# EAGLE design Solar Charge Controller_ver2 (EAGLE 9.6.2)
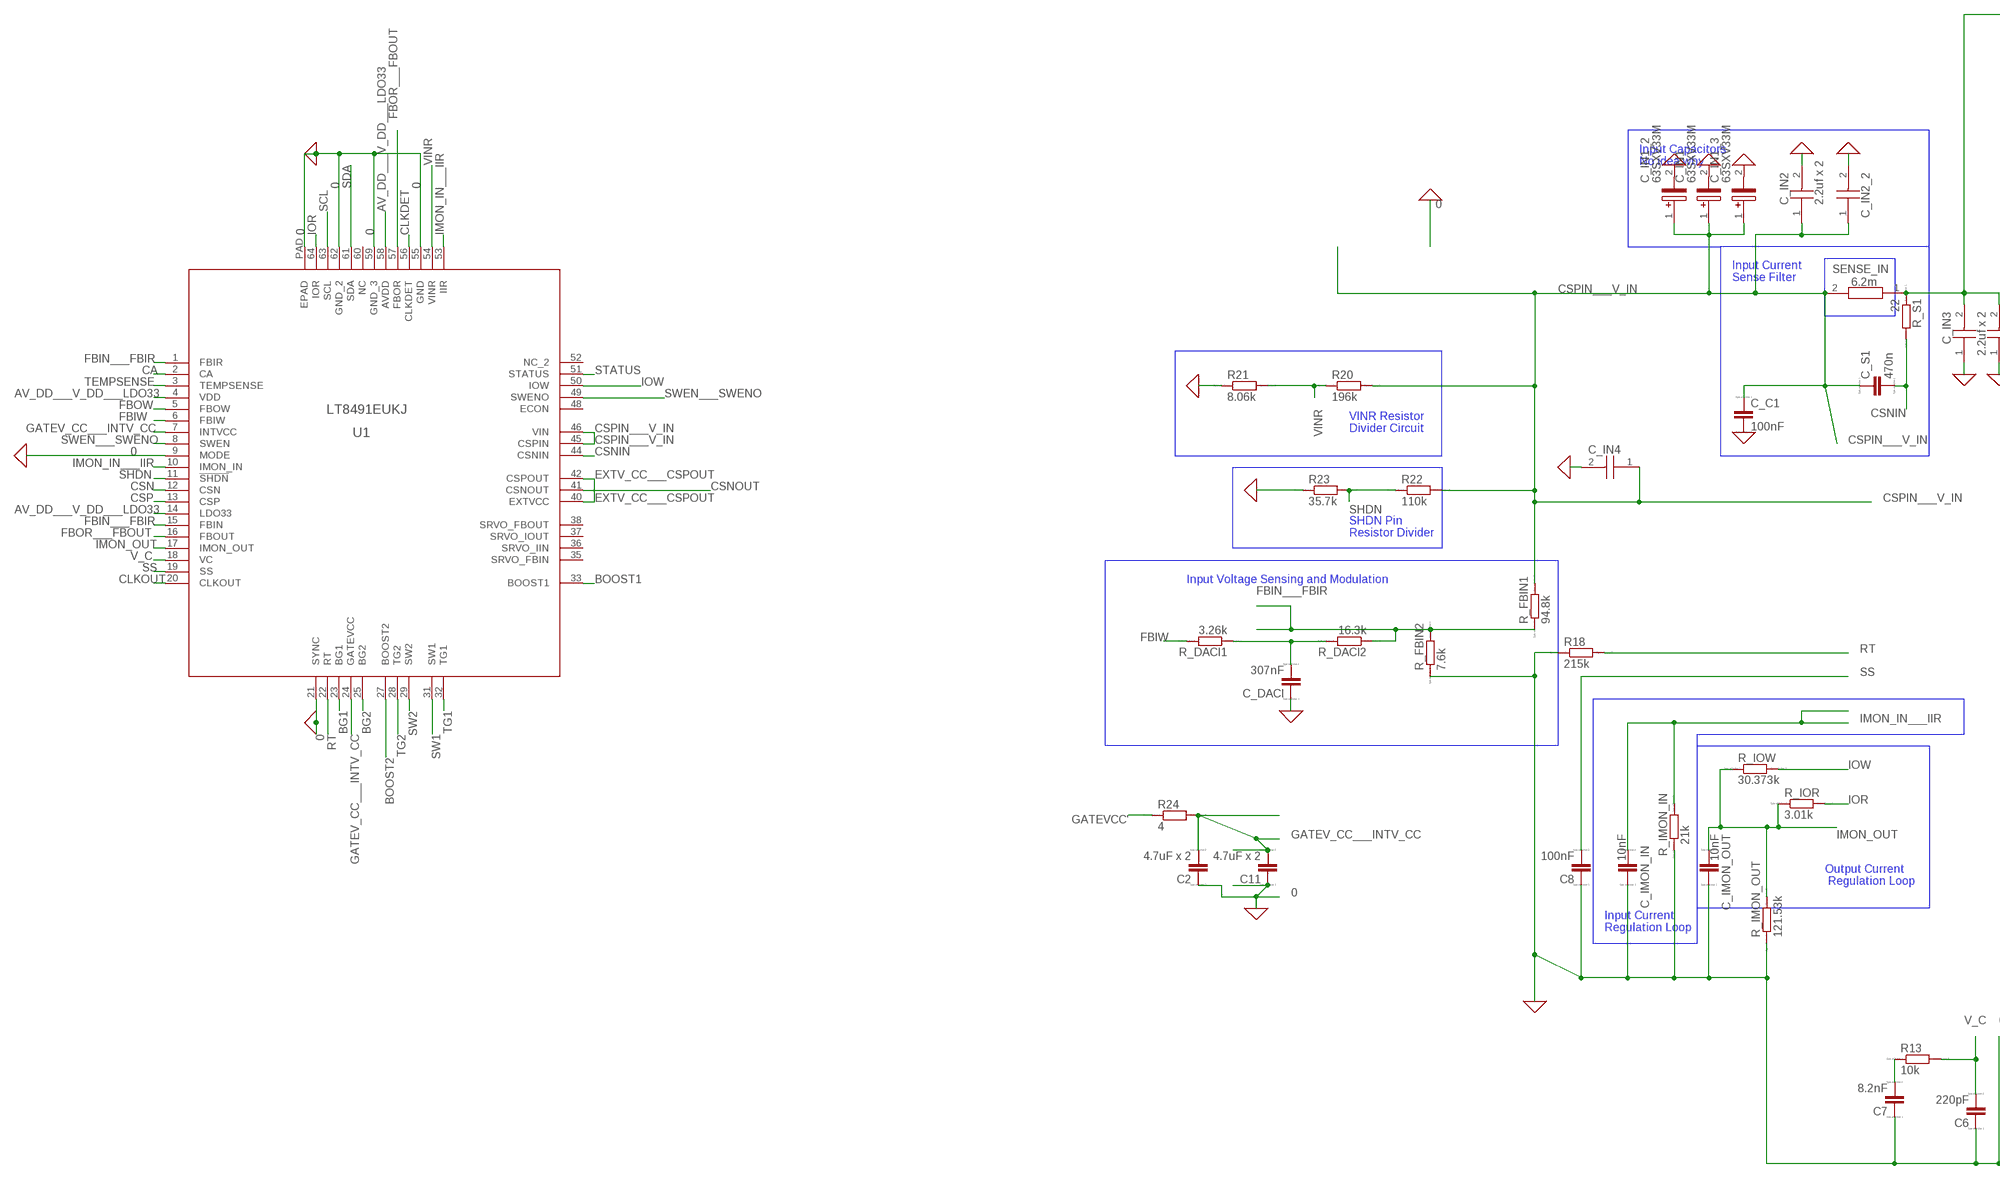
[diagram p0: schematic, sheet 1, part 1 of 2]
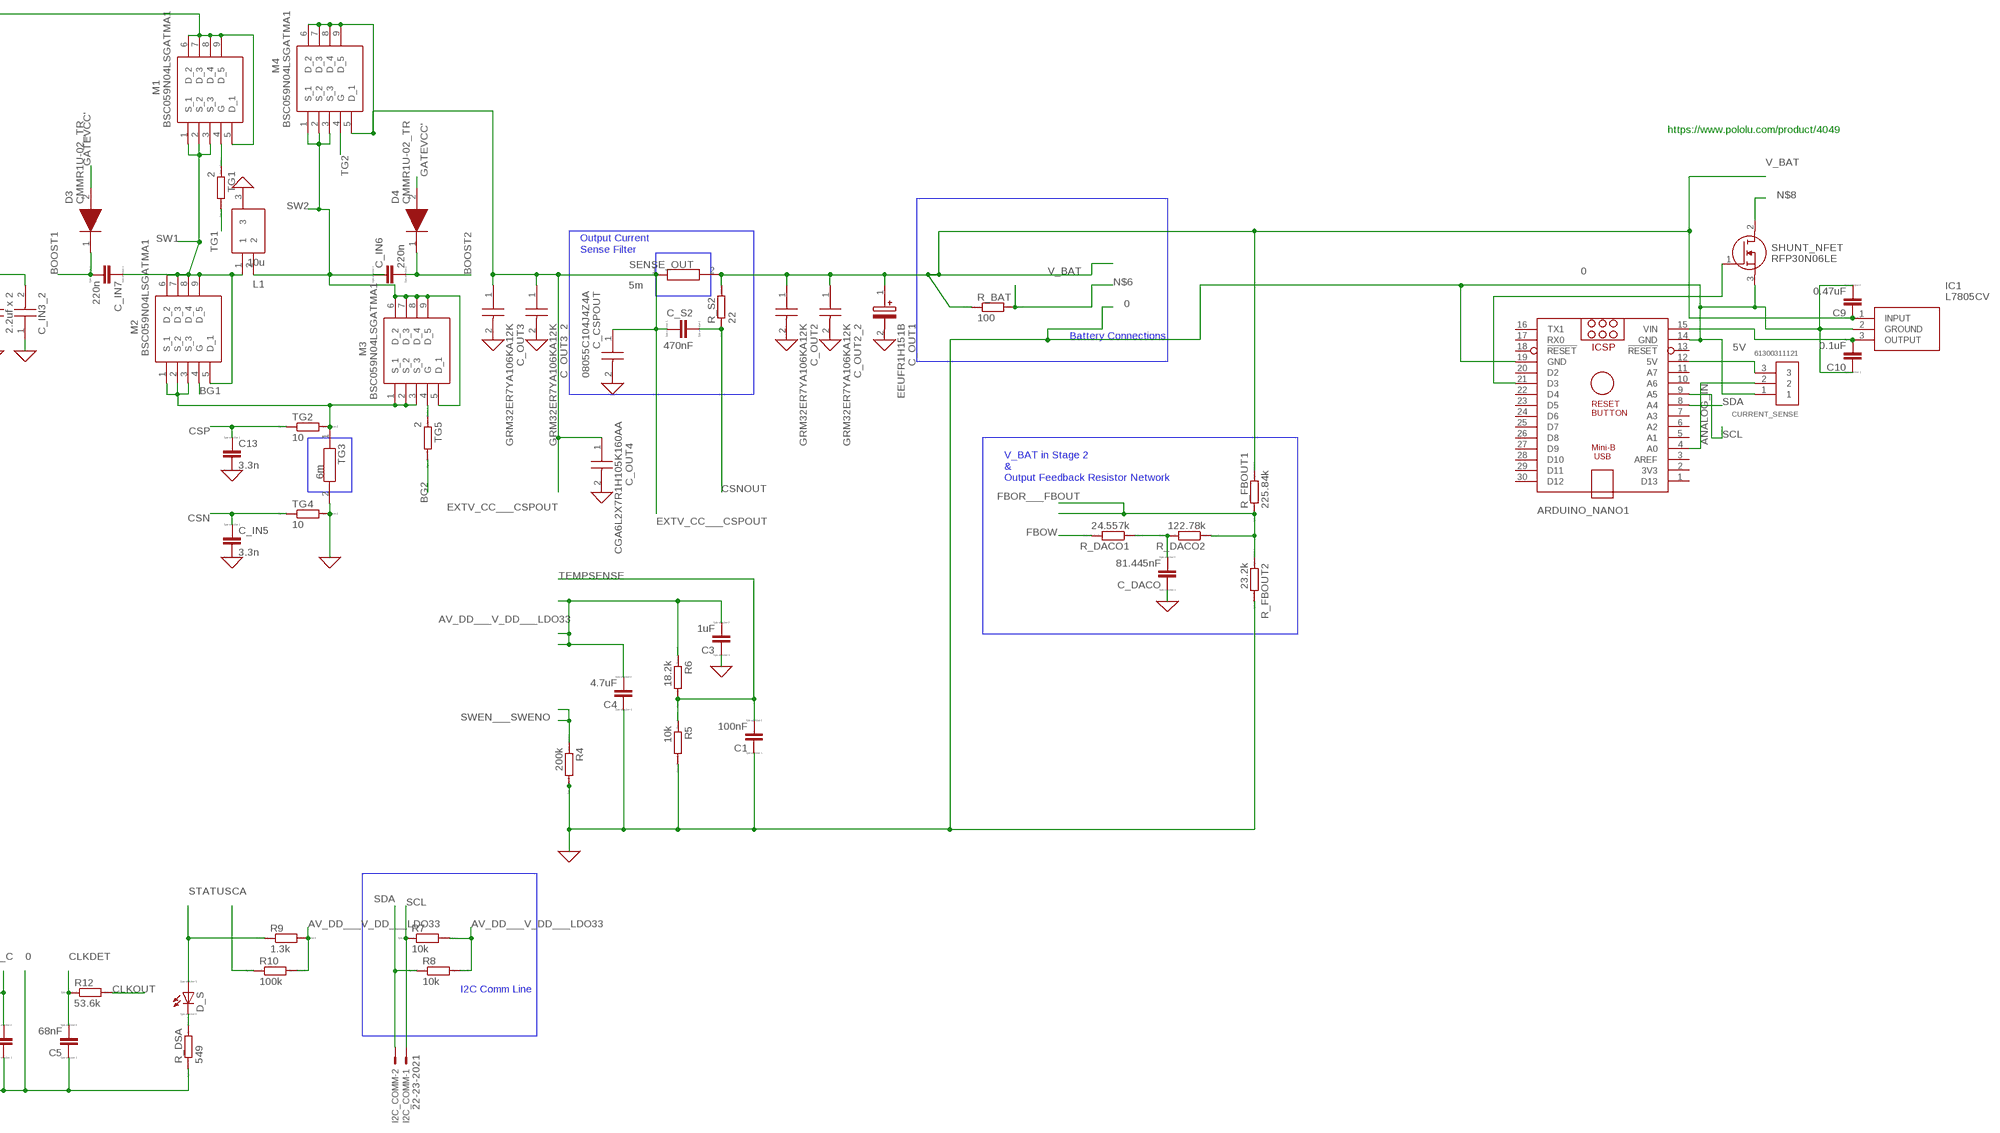
[diagram p1: schematic, sheet 1, part 2 of 2]

## Parts
ARDUINO_NANO1  ARDUINO_NANO  [ARDUINO_NANO]
C1  100nF  CC1206  [C1206]
C2  4.7uF x 2  CC1206  [C1206]
C3  1uF  CC1206  [C1206]
C4  4.7uF  CC1206  [C1206]
C5  68nF  CC0603  [C0603]
C6  220pF  CC1206  [C1206]
C7  8.2nF  CC1206  [C1206]
C8  100nF  CC1206  [C1206]
C9  0.47uF  CC1206  [C1206]
C10  0.1uF  CC1206  [C1206]
C11  4.7uF x 2  CC1206  [C1206]
C13  3.3n  CC1206  [C1206]
C_C1  100nF  CC1206  [C1206]
C_CSPOUT  08055C104J4Z4A  [CAPC2012X127N]
C_DACI  307nF  CC1206  [C1206]
C_DACO  81.445nF  CC1206  [C1206]
C_IMON_IN  10nF  CC1206  [C1206]
C_IMON_OUT  10nF  CC1206  [C1206]
C_IN1  63SXV33M  [CAPAE830X1200N]
C_IN1_2  63SXV33M  [CAPAE830X1200N]
C_IN1_3  63SXV33M  [CAPAE830X1200N]
C_IN2  2.2uf x 2  12101C225KAT2A  [CAPC3325X279N]
C_IN2_2  2.2uf x 2  12101C225KAT2A  [CAPC3325X279N]
C_IN3  2.2uf x 2  12101C225KAT2A  [CAPC3325X279N]
C_IN3_2  2.2uf x 2  12101C225KAT2A  [CAPC3325X279N]
C_IN4  2.2uf  12101C225KAT2A  [CAPC3325X279N]
C_IN5  3.3n  CC1206  [C1206]
C_IN6  220n  CC1206  [C1206]
C_IN7  220n  CC1206  [C1206]
C_OUT1  EEUFR1H151B  [CAPPRD500W65D1000H1400]
C_OUT2  GRM32ER7YA106KA12K  [CAPC3225X270N]
C_OUT2_2  GRM32ER7YA106KA12K  [CAPC3225X270N]
C_OUT3  GRM32ER7YA106KA12K  [CAPC3225X270N]
C_OUT3_2  GRM32ER7YA106KA12K  [CAPC3225X270N]
C_OUT4  CGA6L2X7R1H105K160AA  [CAPC3225X280N]
C_S1  470n  CC1206  [C1206]
C_S2  470nF  CC1206  [C1206]
CURRENT_SENSE  61300311121  [61300311121]
D3  CMMR1U-02_TR  [SODFL3818X108N]
D4  CMMR1U-02_TR  [SODFL3818X108N]
D_S  LED_E  [LED_1206]
I2C_COMM  22-23-2021  [22-23-2021]
IC1  L7805CV  [TO255P460X1020X2008-3P]
L1  10u  SER2915H-103KL  [SER2900]
M1  BSC059N04LSGATMA1  [BSC080N03LSG]
M2  BSC059N04LSGATMA1  [BSC080N03LSG]
M3  BSC059N04LSGATMA1  [BSC080N03LSG]
M4  BSC059N04LSGATMA1  [BSC080N03LSG]
R4  200k  RR1206  [R1206]
R5  10k  RR1206  [R1206]
R6  18.2k  RR1206  [R1206]
R7  10k  RR1206  [R1206]
R8  10k  RR1206  [R1206]
R9  1.3k  RR1206  [R1206]
R10  100k  RR1206  [R1206]
R12  53.6k  RR1206  [R1206]
R13  10k  RR1206  [R1206]
R18  215k  RR1206  [R1206]
R20  196k  RR1206  [R1206]
R21  8.06k  RR1206  [R1206]
R22  110k  RR1206  [R1206]
R23  35.7k  RR1206  [R1206]
R24  4  RR1206  [R1206]
R_BAT  100  RR1206  [R1206]
R_DACI1  3.26k  RR1206  [R1206]
R_DACI2  16.3k  RR1206  [R1206]
R_DACO1  24.557k  RR1206  [R1206]
R_DACO2  122.78k  RR1206  [R1206]
R_DSA  549  RR1206  [R1206]
R_FBIN1  94.8k  RR1206  [R1206]
R_FBIN2  7.6k  RR1206  [R1206]
R_FBOUT1  225.84k  RR1206  [R1206]
R_FBOUT2  23.2k  RR1206  [R1206]
R_IMON_IN  21k  RR1206  [R1206]
R_IMON_OUT  121.53k  RR1206  [R1206]
R_IOR  3.01k  RR1206  [R1206]
R_IOW  30.373k  RR1206  [R1206]
R_S1  22  RR1206  [R1206]
R_S2  22  RR1206  [R1206]
SENSE_IN  6.2m  ERJ6LWFR006V  [RESC2012X80N]
SENSE_OUT  5m  ERJ-MP2MF5M0U  [RESC3216X89N]
SHUNT_NFET  RFP30N06LE  [TO254P470X1016X2019-3P]
TG1  2  RR1206  [R1206]
TG2  10  RR1206  [R1206]
TG3  6m  ERJ6LWFR006V  [RESC2012X80N]
TG4  10  RR1206  [R1206]
TG5  2  RR1206  [R1206]
U1  LT8491EUKJ  [QFN64(58)-UKJ-REV0_ADI]

## Nets
0: ARDUINO_NANO1.14(GND) ARDUINO_NANO1.19(GND) C1.1 C2.1 C3.1 C4.1 C5.1 C6.1 C7.1 C8.1 C9.2 C10.1 C11.1 C13.2 C_C1.2 C_CSPOUT.2 C_DACI.1 C_DACO.1 C_IMON_IN.1 C_IMON_OUT.1 C_IN1.2(-) C_IN1_2.2(-) C_IN1_3.2(-) C_IN2.2 C_IN2_2.2 C_IN3.1 C_IN3_2.1 C_IN4.2 C_IN5.2 C_OUT1.2(-) C_OUT2.2 C_OUT2_2.2 C_OUT3.2 C_OUT3_2.2 C_OUT4.2 CURRENT_SENSE.1 IC1.2(GROUND) L1.3 R4.2 R5.2 R18.1 R21.1 R23.1 R_DSA.1 R_FBIN2.1 R_FBOUT2.2 R_IMON_IN.1 R_IMON_OUT.1 SHUNT_NFET.3(S) TG3.2 TG4.2 U1.9(MODE) U1.21(SYNC) U1.55(GND) U1.59(GND_3) U1.62(GND_2) U1.PAD(EPAD) ; supply symbol labelled GND
5V: ARDUINO_NANO1.12(5V) CURRENT_SENSE.3
ANALOG_IN: ARDUINO_NANO1.4(A0) CURRENT_SENSE.2
AV_DD___V_DD___LDO33: C3.2 C4.2 R6.1 R7.2 R8.2 R9.2 R10.2 U1.4(VDD) U1.14(LDO33) U1.58(AVDD)
BG1: M2.4(G) U1.23(BG1)
BG2: TG5.2 U1.25(BG2)
BOOST1: C_IN7.2 D3.1(K) U1.33(BOOST1)
BOOST2: C_IN6.2 D4.1(K) U1.27(BOOST2)
CA: R10.1 U1.2(CA)
CLKDET: C5.2 R12.1 U1.56(CLKDET)
CLKOUT: R12.2 U1.20(CLKOUT)
CSN: C_IN5.1 TG4.1 U1.12(CSN)
CSNIN: C_S1.2 R_S1.2 U1.44(CSNIN)
CSNOUT: C_S2.2 R_S2.1 U1.41(CSNOUT)
CSP: C13.1 TG2.1 U1.13(CSP)
CSPIN___V_IN: C_C1.1 C_IN1.1(+) C_IN1_2.1(+) C_IN1_3.1(+) C_IN2.1 C_IN2_2.1 C_IN4.1 C_S1.1 R20.2 R22.2 R_FBIN1.2 SENSE_IN.2 U1.45(CSPIN) U1.46(VIN)
EXTV_CC___CSPOUT: C_CSPOUT.1 C_OUT3.1 C_OUT3_2.1 C_OUT4.1 C_S2.1 M4.5(D_1) M4.6(D_2) M4.7(D_3) M4.8(D_4) M4.9(D_5) SENSE_OUT.1 U1.40(EXTVCC) U1.42(CSPOUT)
FBIN___FBIR: R_DACI2.1 R_FBIN1.1 R_FBIN2.2 U1.1(FBIR) U1.15(FBIN)
FBIW: R_DACI1.2 U1.6(FBIW)
FBOR___FBOUT: R_DACO2.1 R_FBOUT1.1 R_FBOUT2.1 U1.16(FBOUT) U1.57(FBOR)
FBOW: R_DACO1.2 U1.5(FBOW)
GATEV_CC___INTV_CC: C2.2 C11.2 R24.2 U1.7(INTVCC) U1.24(GATEVCC)
GATEVCC': D3.2(A) D4.2(A) R24.1
IMON_IN___IIR: C_IMON_IN.2 R_IMON_IN.2 U1.10(IMON_IN) U1.53(IIR)
IMON_OUT: C_IMON_OUT.2 R_IMON_OUT.2 R_IOR.1 R_IOW.1 U1.17(IMON_OUT)
IOR: R_IOR.2 U1.64(IOR)
IOW: R_IOW.2 U1.50(IOW)
N$1: C_IN3.2 C_IN3_2.2 M1.5(D_1) M1.6(D_2) M1.7(D_3) M1.8(D_4) M1.9(D_5) R_S1.1 SENSE_IN.1
N$2: M2.1(S_1) M2.2(S_2) M2.3(S_3) M3.1(S_1) M3.2(S_2) M3.3(S_3) TG2.2 TG3.1
N$3: M1.4(G) TG1.1
N$4: C_DACI.2 R_DACI1.1 R_DACI2.2
N$5: M3.4(G) TG5.1
N$6: R_BAT.2
N$7: ARDUINO_NANO1.15(VIN) C10.2 IC1.3(OUTPUT)
N$8: SHUNT_NFET.2(D)
N$9: ARDUINO_NANO1.21(D3) SHUNT_NFET.1(G)
N$23: C_DACO.2 R_DACO1.1 R_DACO2.2
N$28: D_S.C R_DSA.2
N$32: C7.2 R13.1
RT: R18.2 U1.22(RT)
SCL: ARDUINO_NANO1.9(A5) I2C_COMM.1 R7.1 U1.63(SCL)
SDA: ARDUINO_NANO1.8(A4) I2C_COMM.2 R8.1 U1.61(SDA)
SHDN: R22.1 R23.2 U1.11(!SHDN)
SS: C8.2 U1.19(SS)
STATUS: D_S.A R9.1 U1.51(STATUS)
SW1: C_IN7.1 L1.1 M1.1(S_1) M1.2(S_2) M1.3(S_3) M2.5(D_1) M2.6(D_2) M2.7(D_3) M2.8(D_4) M2.9(D_5) U1.31(SW1)
SW2: C_IN6.1 L1.2 M3.5(D_1) M3.6(D_2) M3.7(D_3) M3.8(D_4) M3.9(D_5) M4.1(S_1) M4.2(S_2) M4.3(S_3) U1.29(SW2)
SWEN___SWENO: R4.1 U1.8(SWEN) U1.49(SWENO)
TEMPSENSE: C1.2 R5.1 R6.2 U1.3(TEMPSENSE)
TG1: TG1.2 U1.32(TG1)
TG2: M4.4(G) U1.28(TG2)
V_BAT: C9.1 C_OUT1.1(+) C_OUT2.1 C_OUT2_2.1 IC1.1(INPUT) R_BAT.1 R_FBOUT1.2 R_S2.2 SENSE_OUT.2
V_C: C6.2 R13.2 U1.18(VC)
VINR: R20.1 R21.2 U1.54(VINR)
Unconnected: ARDUINO_NANO1.1(D13) ARDUINO_NANO1.2(3V3) ARDUINO_NANO1.3(AREF) ARDUINO_NANO1.5(A1) ARDUINO_NANO1.6(A2) ARDUINO_NANO1.7(A3) ARDUINO_NANO1.10(A6) ARDUINO_NANO1.11(A7) ARDUINO_NANO1.13(!RESET) ARDUINO_NANO1.16(TX1) ARDUINO_NANO1.17(RX0) ARDUINO_NANO1.18(!RESET) ARDUINO_NANO1.20(D2) ARDUINO_NANO1.22(D4) ARDUINO_NANO1.23(D5) ARDUINO_NANO1.24(D6) ARDUINO_NANO1.25(D7) ARDUINO_NANO1.26(D8) ARDUINO_NANO1.27(D9) ARDUINO_NANO1.28(D10) ARDUINO_NANO1.29(D11) ARDUINO_NANO1.30(D12) U1.35(SRVO_FBIN) U1.36(SRVO_IIN) U1.37(SRVO_IOUT) U1.38(SRVO_FBOUT) U1.48(ECON) U1.52(NC_2) U1.60(NC)

## Notes on the sheet
- https://www.pololu.com/product/4049
- Input Capacitors
  No idea why
- Output Current
  Sense Filter
- Input Current
  Sense Filter
- Battery Connections
- VINR Resistor
  Divider Circuit
- V_BAT in Stage 2
  &
  Output Feedback Resistor Network
- SHDN Pin
  Resistor Divider
- Input Voltage Sensing and Modulation
- Output Current
   Regulation Loop
- Input Current
  Regulation Loop
- I2C Comm Line

## Library data of the parts
ARDUINO_NANO1 = ArduinoNanoV30:ARDUINO_NANO: Arduino Nano V3.0 Overview: The Arduino Nano is a small, complete, and breadboard-friendly board based on the ATmega328 (Arduino Nano 3.x) or ATmega168 (Arduino Nano 2.x). It has more or less the same functionality of the Arduino Duemilanove, but in a different package. It lacks only a DC power jack, and works with a Mini-B USB cable instead of a standard one. The Nano was designed and is being produced by Gravitech. Specifications: Microcontroller Atmel ATmega168 or ATmega328 Operating Voltage (logic level) 5 V Input Voltage (recommended) 7-12 V Input Voltage (limits) 6-20 V Digital I/O Pins 14 (of which 6 provide PWM output) Analog Input Pins 8 DC Current per I/O Pin 40 mA Flash Memory 16 KB (ATmega168) or 32 KB (ATmega328) of which 2 KB used by bootloader SRAM 1 KB (ATmega168) or 2 KB (ATmega328) EEPROM 512 bytes (ATmega168) or 1 KB (ATmega328) Clock Speed 16 MHz Dimensions 0.73" x 1.70" Length 45 mm Width 18 mm Weigth 5 g Power: The Arduino Nano can be powered via the Mini-B USB connection, 6-20V unregulated external power supply (pin 30), or 5V regulated external power supply (pin 27). The power source is automatically selected to the highest voltage source. Memory: The ATmega168 has 16 KB of flash memory for storing code (of which 2 KB is used for the bootloader); the ATmega328 has 32 KB, (also with 2 KB used for the bootloader). The ATmega168 has 1 KB of SRAM and 512 bytes of EEPROM (which can be read and written with the EEPROM library); the ATmega328 has 2 KB of SRAM and 1 KB of EEPROM. Input and Output: Each of the 14 digital pins on the Nano can be used as an input or output, using pinMode(), digitalWrite(), and digitalRead() functions. They operate at 5 volts. Each pin can provide or receive a maximum of 40 mA and has an internal pull-up resistor (disconnected by default) of 20-50 kOhms. In addition, some pins have specialized functions. Visit Arduino - ArduinoBoardNano <https://www.arduino.cc/en/Main/ArduinoBoardNano>
C1-C11 C13 C_C1 C_DACI C_DACO C_IMON_IN C_IMON_OUT C_IN5-C_IN7 C_S1 C_S2 = eagle-ltspice:C: CAPACITOR, European symbol; SPICEMODEL: NONE; SPICEPREFIX: C
C_CSPOUT = 08055C104J4Z4A:08055C104J4Z4A: Cap Ceramic 0.1uF 50V X7R 5% SMD 0805 FlexiTerm 125C Paper T/R Source: Datasheet <http://catalogs.avx.com/SurfaceMount.pdf>; ARROW_PART_NUMBER: 08055C104J4Z4A; ARROW_PRICE-STOCK: https://www.arrow.com/en/products/08055c104j4z4a/avx; DESCRIPTION: Cap Ceramic 0.1uF 50V X7R 5% SMD 0805 FlexiTerm 125C Paper T/R; HEIGHT: 1.27mm; MANUFACTURER_NAME: AVX; MANUFACTURER_PART_NUMBER: 08055C104J4Z4A; MOUSER_PART_NUMBER: 581-08055C104J4Z4A; MOUSER_PRICE-STOCK: https://www.mouser.co.uk/ProductDetail/AVX/08055C104J4Z4A?qs=xMTsDkQFXIw7L45hGtT%2Fjg%3D%3D
C_IN1 C_IN1_2 C_IN1_3 = 63SXV33M:63SXV33M: PANASONIC ELECTRONIC COMPONENTS - 63SXV33M - CAP, ALU POLYMER, 33UF, 63V, RAD CAN Source: Datasheet <https://industrial.panasonic.com/cdbs/www-data/pdf/AAB8000/AAB8000C259.pdf>; ARROW_PART_NUMBER: 63SXV33M; ARROW_PRICE-STOCK: https://www.arrow.com/en/products/63sxv33m/panasonic; DESCRIPTION: PANASONIC ELECTRONIC COMPONENTS - 63SXV33M - CAP, ALU POLYMER, 33UF, 63V, RAD CAN; HEIGHT: 12mm; MANUFACTURER_NAME: Panasonic; MANUFACTURER_PART_NUMBER: 63SXV33M; MOUSER_PART_NUMBER: 667-63SXV33M; MOUSER_PRICE-STOCK: https://www.mouser.co.uk/ProductDetail/Panasonic/63SXV33M?qs=LkACrQhHtvC3OEKZ9h0MUg%3D%3D
C_IN2 C_IN2_2 C_IN3 C_IN3_2 C_IN4 = 12101C225KAT2A:12101C225KAT2A: AVX 1210 Standard 2.2 Source: Datasheet <http://datasheets.avx.com/X7RDielectric.pdf>; ARROW_PART_NUMBER: 12101C225KAT2A; ARROW_PRICE-STOCK: https://www.arrow.com/en/products/12101c225kat2a/avx; DESCRIPTION: AVX 1210 Standard 2.2; HEIGHT: 2.79mm; MANUFACTURER_NAME: AVX; MANUFACTURER_PART_NUMBER: 12101C225KAT2A; MOUSER_PART_NUMBER: 581-12101C225KAT2A; MOUSER_PRICE-STOCK: https://www.mouser.co.uk/ProductDetail/AVX/12101C225KAT2A?qs=sEn5VCT5Piadpj%252BmhssWtA%3D%3D
C_OUT1 = EEUFR1H151B:EEUFR1H151B: Cap Aluminum Lytic 150uF 50V 20% (10 X 12.5mm) Radial 5mm 1170mA 6000h 105C Ammo Source: Datasheet <https://www.mouser.com/datasheet/2/315/ABA0000C1022-1144690.pdf>; DESCRIPTION: Cap Aluminum Lytic 150uF 50V 20% (10 X 12.5mm) Radial 5mm 1170mA 6000h 105C Ammo; HEIGHT: 14mm; MANUFACTURER_NAME: Panasonic; MANUFACTURER_PART_NUMBER: EEUFR1H151B
C_OUT2 C_OUT2_2 C_OUT3 C_OUT3_2 = GRM32ER7YA106KA12K:GRM32ER7YA106KA12K: Multilayer Ceramic Capacitors MLCC - SMD/SMT Source: Datasheet <http://psearch.en.murata.com/capacitor/product/GRM32ER71E226KE15#.pdf>; ARROW_PART_NUMBER: GRM32ER7YA106KA12K; ARROW_PRICE-STOCK: https://www.arrow.com/en/products/grm32er7ya106ka12k/murata-manufacturing; DESCRIPTION: Multilayer Ceramic Capacitors MLCC - SMD/SMT; HEIGHT: 2.7mm; MANUFACTURER_NAME: Murata Electronics; MANUFACTURER_PART_NUMBER: GRM32ER7YA106KA12K; MOUSER_PART_NUMBER: 81-GRM32ER7YA106KA2K; MOUSER_PRICE-STOCK: https://www.mouser.com/Search/Refine.aspx?Keyword=81-GRM32ER7YA106KA2K
C_OUT4 = CGA6L2X7R1H105K160AA:CGA6L2X7R1H105K160AA: TDK CGA6L2X7R1H105K160AA 1F MLCC 50V dc +/-10% Tolerance SMD Source: Datasheet <https://www.mouser.com/datasheet/2/400/lcc_automotive_general_en-843974.pdf>; ARROW_PART_NUMBER: CGA6L2X7R1H105K160AA; ARROW_PRICE-STOCK: https://www.arrow.com/en/products/cga6l2x7r1h105k160aa/tdk; DESCRIPTION: TDK CGA6L2X7R1H105K160AA 1F MLCC 50V dc +/-10% Tolerance SMD; HEIGHT: 2.8mm; MANUFACTURER_NAME: TDK; MANUFACTURER_PART_NUMBER: CGA6L2X7R1H105K160AA; MOUSER_PART_NUMBER: 810-CGA6L2X7R1H105K; MOUSER_PRICE-STOCK: https://www.mouser.com/Search/Refine.aspx?Keyword=810-CGA6L2X7R1H105K
CURRENT_SENSE = Headers:61300311121: CONN HEADER VERT 3POS 2.54MM Manufacturer's datasheet <https://katalog.we-online.de/em/datasheet/6130xx11121.pdf>; CREATED_BY: PCBLayout.com; DIGI_KEY_PART_NUMBER: 732-5316-ND; MANUFACTURER: Wurth Electronics Inc.; MPN: 61300311121
D3 D4 = CMMR1U-02_TR:CMMR1U-02_TR: Rectifiers Ultra Fast Rectifier Single Source: Datasheet <https://www.centralsemi.com/get_document.php?cmp=1&mergetype=pd&mergepath=pd&pdf_id=CMMR1U_SERIES.PDF>; DESCRIPTION: Rectifiers Ultra Fast Rectifier Single; HEIGHT: 1.08mm; MANUFACTURER_NAME: Central Semiconductor; MANUFACTURER_PART_NUMBER: CMMR1U-02 TR; MOUSER_PART_NUMBER: 610-CMMR1U-02; MOUSER_PRICE-STOCK: https://www.mouser.com/Search/Refine.aspx?Keyword=610-CMMR1U-02
D_S = eagle-ltspice:LED_E: LED Source: http://www.osram.convergy.de Source: www.luxeon.com Source: www.kingbright.com; SPICEMODEL: NONE; SPICEPREFIX: D; SPICETYPE: diode
I2C_COMM = con-molex:22-23-2021: .100" (2.54mm) Center Header - 2 Pin; MF: MOLEX; MPN: 22-23-2021; OC_FARNELL: 1462926; OC_NEWARK: 25C3832
IC1 = L7805CV:L7805CV: Linear voltage regulator,L7805CV 5V 1.5A STMicroelectronics L7805CV, Single Linear Voltage Regulator, 1.5A 5 V, 3-Pin TO-220 Source: Datasheet <http://www.st.com/web/en/resource/technical/document/datasheet/CD00000444.pdf>; ARROW_PART_NUMBER: L7805CV; ARROW_PRICE-STOCK: https://www.arrow.com/en/products/l7805cv/stmicroelectronics; DESCRIPTION: Linear voltage regulator,L7805CV 5V 1.5A STMicroelectronics L7805CV, Single Linear Voltage Regulator, 1.5A 5 V, 3-Pin TO-220; HEIGHT: 4.6mm; MANUFACTURER_NAME: STMicroelectronics; MANUFACTURER_PART_NUMBER: L7805CV; MOUSER_PART_NUMBER: 511-L7805CV; MOUSER_PRICE-STOCK: https://www.mouser.co.uk/ProductDetail/STMicroelectronics/L7805CV/?qs=9NrABl3fj%2FqplZAHiYUxWg%3D%3D
L1 = SER2915H-103KL:SER2915H-103KL: Fixed Inductors SER2915H Hi Current 10 uH 10 % 30 A Source: Datasheet <http://www.coilcraft.com/pdfs/ser2900.pdf>; DESCRIPTION: Fixed Inductors SER2915H Hi Current 10 uH 10 % 30 A; HEIGHT: mm; MANUFACTURER_NAME: COILCRAFT; MANUFACTURER_PART_NUMBER: SER2915H-103KL; MOUSER_PART_NUMBER: 994-SER2915H-103KL; MOUSER_PRICE-STOCK: https://www.mouser.co.uk/ProductDetail/Coilcraft/SER2915H-103KL?qs=zCSbvcPd3pbm6JOcdM0KSg%3D%3D
M1-M4 = BSC059N04LSGATMA1:BSC059N04LSGATMA1: MOSFET N-Ch 40V 73A TDSON-8 OptiMOS 3 Source: Datasheet <https://www.infineon.com/dgdl/BSC059N04LSG_rev1.02.pdf?folderId=db3a3043156fd5730115c7d50620107c&fileId=db3a30431689f4420116c4481e4b081f>; ARROW_PART_NUMBER: BSC059N04LSGATMA1; ARROW_PRICE-STOCK: https://www.arrow.com/en/products/bsc059n04lsgatma1/infineon-technologies-ag; DESCRIPTION: MOSFET N-Ch 40V 73A TDSON-8 OptiMOS 3; HEIGHT: mm; MANUFACTURER_NAME: Infineon; MANUFACTURER_PART_NUMBER: BSC059N04LSGATMA1; MOUSER_PART_NUMBER: 726-BSC059N04LSGATMA; MOUSER_PRICE-STOCK: https://www.mouser.co.uk/ProductDetail/Infineon-Technologies/BSC059N04LSGATMA1/?qs=OwbwYO03UsIeXsXqrPLFnQ%3D%3D
R4-R10 R12 R13 R18 R20-R24 R_BAT R_DACI1 R_DACI2 R_DACO1 R_DACO2 R_DSA R_FBIN1 R_FBIN2 R_FBOUT1 R_FBOUT2 R_IMON_IN R_IMON_OUT R_IOR R_IOW R_S1 R_S2 TG1 TG2 TG4 TG5 = eagle-ltspice:R: RESISTOR, European symbol; SPICEMODEL: NONE; SPICEPREFIX: R
SENSE_IN TG3 = ERJ6LWFR006V:ERJ6LWFR006V: Res Current Sense Thick Film 0805 0.006 Ohm 1% 1/2W 0ppm/C to 300ppm/C Molded Paper T/R - Tape and Reel Source: Datasheet <https://4donline.ihs.com/images/VipMasterIC/IC/PANA/PANA-S-A0009017013/PANA-S-A0009017013-1.pdf?hkey=EF798316E3902B6ED9A73243A3159BB0>; DESCRIPTION: Res Current Sense Thick Film 0805 0.006 Ohm 1% 1/2W 0ppm/C to 300ppm/C Molded Paper T/R - Tape and Reel; HEIGHT: 0.8mm; MANUFACTURER_NAME: Panasonic; MANUFACTURER_PART_NUMBER: ERJ6LWFR006V
SENSE_OUT = ERJ-MP2MF5M0U:ERJ-MP2MF5M0U: Panasonic ERJMP2 Series Metal Plate Current Sensing Surface Mount Resistor 1206 Case 5m +/-1% 1W +/-75ppm/C Source: Datasheet <https://industrial.panasonic.com/cdbs/www-data/pdf/RDN0000/AOA0000C316.pdf>; DESCRIPTION: Panasonic ERJMP2 Series Metal Plate Current Sensing Surface Mount Resistor 1206 Case 5m +/-1% 1W +/-75ppm/C; HEIGHT: 0.89mm; MANUFACTURER_NAME: Panasonic; MANUFACTURER_PART_NUMBER: ERJ-MP2MF5M0U; MOUSER_PART_NUMBER: 667-ERJ-MP2MF5M0U; MOUSER_PRICE-STOCK: https://www.mouser.com/Search/Refine.aspx?Keyword=667-ERJ-MP2MF5M0U
SHUNT_NFET = RFP30N06LE:RFP30N06LE: MOSFET TO-220AB N-Ch Power Source: Datasheet <https://media.digikey.com/pdf/Data Sheets/Fairchild PDFs/RFP30N06LE_RF1S30N06LESM.pdf>; DESCRIPTION: MOSFET TO-220AB N-Ch Power; HEIGHT: 4.7mm; MANUFACTURER_NAME: ON Semiconductor; MANUFACTURER_PART_NUMBER: RFP30N06LE; MOUSER_PART_NUMBER: 512-RFP30N06LE; MOUSER_PRICE-STOCK: https://www.mouser.co.uk/ProductDetail/ON-Semiconductor-Fairchild/RFP30N06LE?qs=mdiO5HdF0KgGbixxeJqneA%3D%3D
U1 = LT8491:LT8491EUKJ; BUILT_BY: SunStream; COPYRIGHT: Copyright (C) 2018 Accelerated Designs. All rights reserved; MANUFACTURER_PART_NUMBER: LT8491EUKJ; SOURCELIBRARY: Analog_Devices_Inc_2020-09-15; VENDOR: Analog Devices Inc

## Net classes
0 default: clearance 0.205 mm

## Board
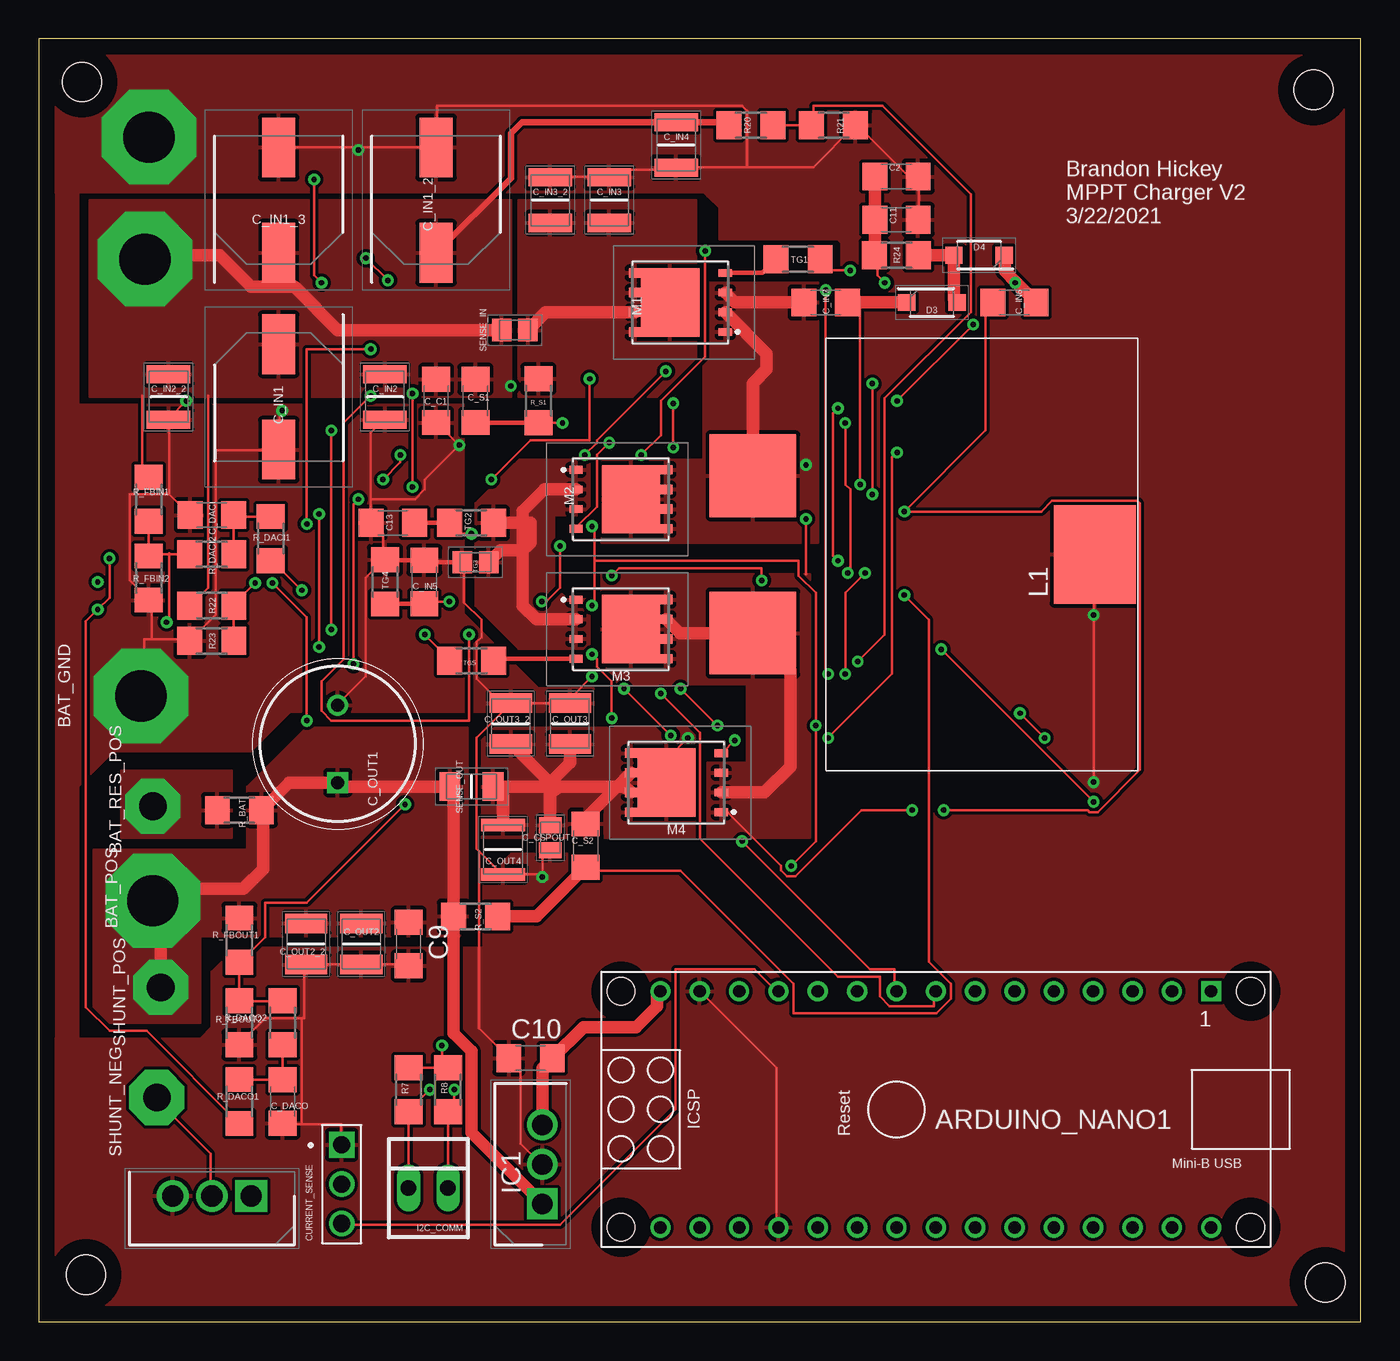
[diagram p2: board, top side]
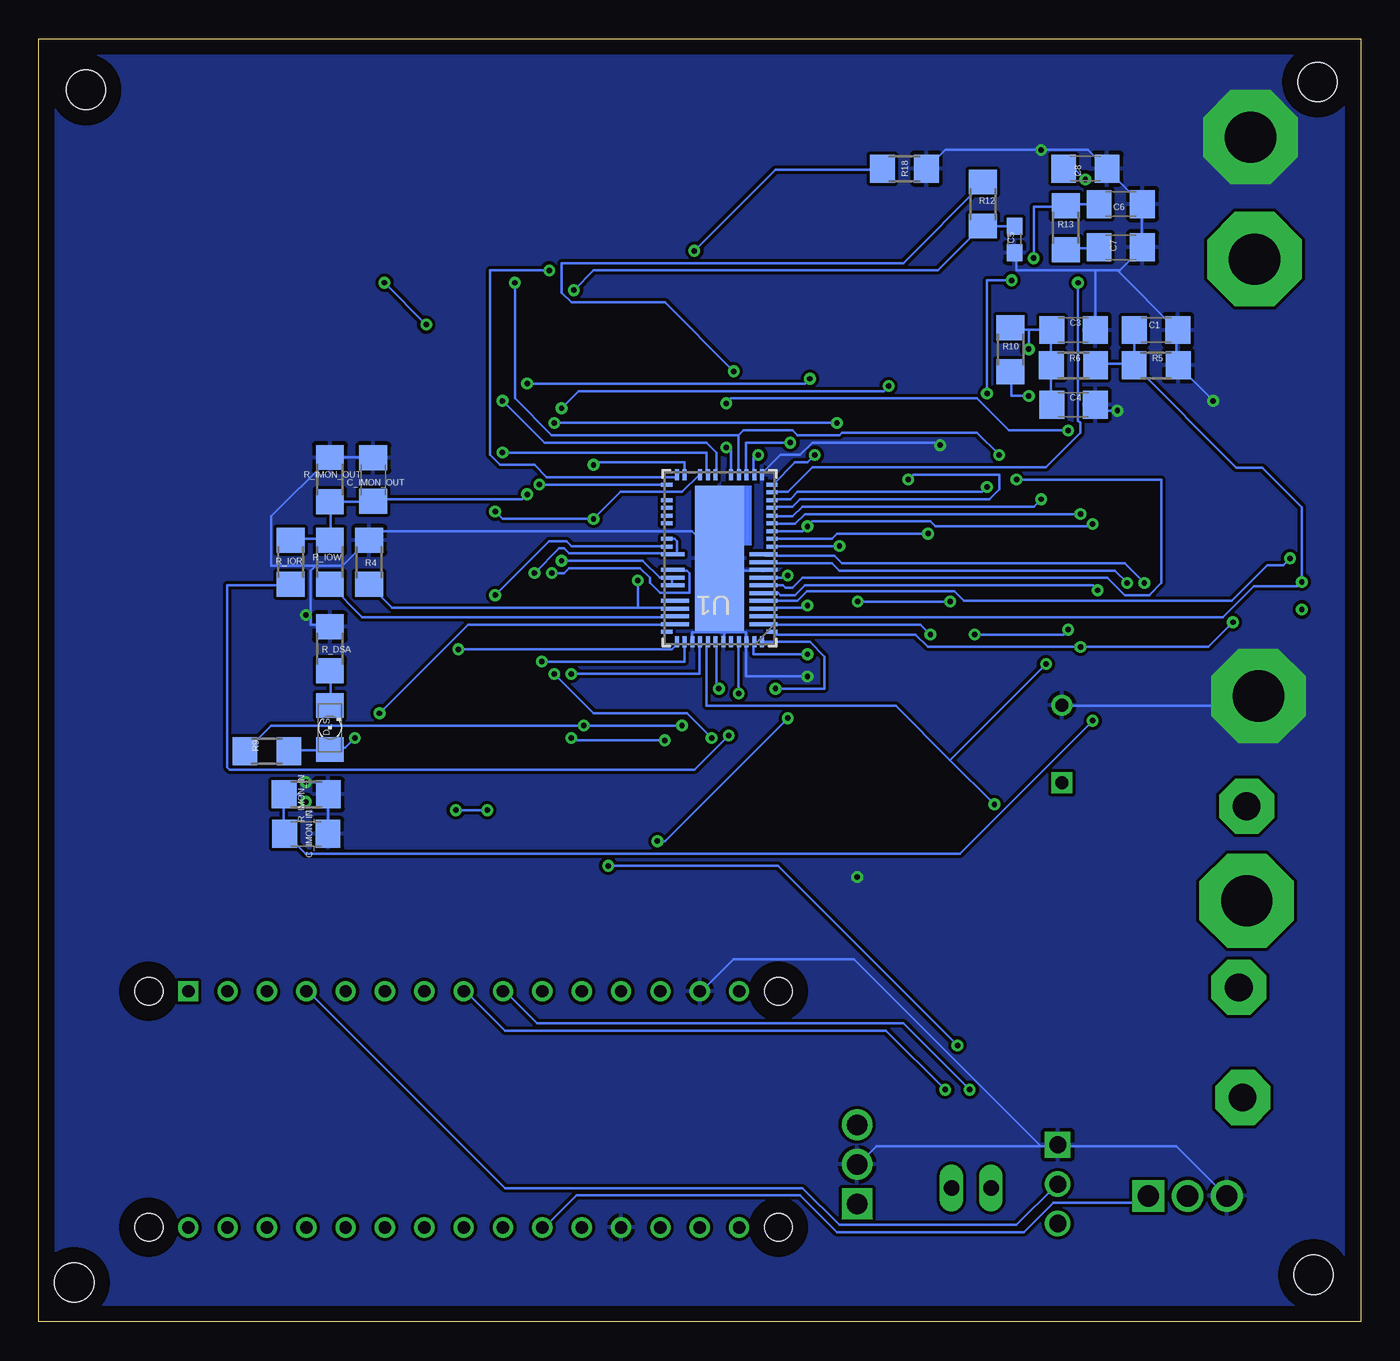
[diagram p3: board, bottom side, seen from below]

Size 85.34 x 82.8 mm. Coordinates in mm from the lower left corner, seen from the top.
Outline: 0,0 85.34,0 85.34,82.8 0,82.8 0,0
Copper layers (1*16): Top 0.035mm / dielectric 1.5mm / Bottom 0.035mm
Design rules "default": minimum track width 6mil, minimum drill 0.35mm, track to track 6mil, track to pad 6mil, pad to pad 6mil, via to via 6mil, smd to smd 6mil, copper to edge 40mil, drill to drill 6mil, minimum pad ring 10mil, minimum via ring 8mil, stop-mask expansion 4mil, vias tented up to drill 0mil, thermal gap 10mil
Holes 2.54 mm at 3.05,3.05 83.06,2.54 82.3,79.5 2.79,80.01

### Footprints (pad centres in the part's own frame; a part is rotated, then mirrored left to right if it is on the bottom)
ARDUINO_NANO = drill 0.8 square: 1 -20.32,-7.62 | drill 0.8: 2 -17.78,-7.62; 3 -15.24,-7.62; 4 -12.7,-7.62; 5 -10.16,-7.62; 6 -7.62,-7.62; 7 -5.08,-7.62; 8 -2.54,-7.62; 9 0,-7.62; 10 2.54,-7.62; 11 5.08,-7.62; 12 7.62,-7.62; 13 10.16,-7.62; 14 12.7,-7.62; 15 15.24,-7.62; 16 15.24,7.62; 17 12.7,7.62; 18 10.16,7.62; 19 7.62,7.62; 20 5.08,7.62; 21 2.54,7.62; 22 0,7.62; 23 -2.54,7.62; 24 -5.08,7.62; 25 -7.62,7.62; 26 -10.16,7.62; 27 -12.7,7.62; 28 -15.24,7.62; 29 -17.78,7.62; 30 -20.32,7.62 | hole 1.778: -22.86,-7.62; -22.86,7.62; 17.78,7.62; 17.78,-7.62
C1206 = smd 1.6 x 1.8: 1 -1.4,0; 2 1.4,0
C0603 = smd 1.1 x 1: 1 -0.85,0; 2 0.85,0
CAPC2012X127N = smd 1.02 x 1.47: 1 -0.81,0; 2 0.81,0
CAPAE830X1200N = smd 3.85 x 2.15: 1 -3.4,0; 2 3.4,0
CAPC3325X279N = smd 1.18 x 2.82: 1 -1.47,0; 2 1.47,0
CAPPRD500W65D1000H1400 = drill 0.85 pad 1.275 square: 1 0,0 | drill 0.85 pad 1.275: 2 5,0
CAPC3225X270N = smd 1.26 x 2.72: 1 -1.33,0; 2 1.33,0
CAPC3225X280N = smd 0.81 x 2.82: 1 -1.6,0; 2 1.6,0
61300311121 = drill 1.1 square: 1 -2.54,0 | drill 1.1: 2 0,0; 3 2.54,0
SODFL3818X108N = smd 1.12 x 1.08: 1 -1.625,0; 2 1.625,0
LED_1206 = smd 1.6 x 1.803: A -1.422,0; C 1.422,0
22-23-2021 = drill 1 long: 1 -1.27,0; 2 1.27,0
TO255P460X1020X2008-3P = drill 1.32 pad 1.98 square: 1 0,0 | drill 1.32 pad 1.98: 2 2.55,0; 3 5.1,0
SER2900 = smd 5.33 x 5.59: 1 -5.075,-14.355; 2 5.075,-14.355 | smd 6.35 x 5.28: 3 0,7.72
BSC080N03LSG = smd 0.5 x 0.85: 1 -1.905,-2.662; 2 -0.635,-2.662; 3 0.635,-2.662; 4 1.905,-2.662 | smd 0.6 x 0.8: 5 1.905,3.163; 6 0.635,3.163; 7 -0.635,3.163; 8 -1.905,3.163 | smd 4.41 x 3.75: 9 0,0.888
R1206 = smd 1.6 x 1.803: 1 -1.422,0; 2 1.422,0
RESC2012X80N = smd 1.25 x 1.45: 1 -0.85,0; 2 0.85,0
RESC3216X89N = smd 1.35 x 1.85: 1 -1.4,0; 2 1.4,0
TO254P470X1016X2019-3P = drill 1.37 pad 2.055 square: 1 0,0 | drill 1.37 pad 2.055: 2 2.535,0; 3 5.07,0
QFN64(58)-UKJ-REV0_ADI = smd 0.711 x 0.254: 1 -3.4,4.751; 12 -3.4,-0.75; 13 -3.4,-1.25; 14 -3.4,-1.75; 15 -3.4,-2.251; 16 -3.4,-2.751; 17 -3.4,-3.251; 18 -3.4,-3.751; 19 -3.4,-4.251; 20 -3.4,-4.751; 33 3.4,-4.751; 35 3.4,-3.751; 36 3.4,-3.251; 37 3.4,-2.751; 38 3.4,-2.251; 40 3.4,-1.25; 41 3.4,-0.75; 52 3.4,4.751 | smd 1.803 x 0.254: 2 -2.854,4.251; 3 -2.854,3.751; 4 -2.854,3.251; 5 -2.854,2.751; 6 -2.854,2.251; 7 -2.854,1.75; 8 -2.854,1.25; 9 -2.854,0.75; 10 -2.854,0.25; 11 -2.854,-0.25; 48 2.854,2.751; 49 2.854,3.251; 50 2.854,3.751; 51 2.854,4.251 | smd 0.254 x 0.711: 21 -2.751,-5.4; 22 -2.251,-5.4; 23 -1.75,-5.4; 24 -1.25,-5.4; 25 -0.75,-5.4; 27 0.25,-5.4; 28 0.75,-5.4; 29 1.25,-5.4; 31 2.251,-5.4; 32 2.751,-5.4; 53 2.751,5.4; 54 2.251,5.4; 55 1.75,5.4; 56 1.25,5.4; 57 0.75,5.4; 58 0.25,5.4; 59 -0.25,5.4; 60 -0.75,5.4; 61 -1.25,5.4; 62 -1.75,5.4; 63 -2.251,5.4; 64 -2.751,5.4 | smd 1.499 x 0.254: 42 3.006,-0.25; 44 3.006,0.75; 45 3.006,1.25; 46 3.006,1.75 | smd 3.15 x 9.373: PAD 0,0

### Placement (x,y rotation side)
ARDUINO_NANO1  55.37,13.72 180 top
C1  13.21,64.01 180 bottom
C2  55.37,73.91 180 top
C3  18.54,64.01 180 bottom
C4  18.54,59.18 180 bottom
C5  22.35,69.85 90 bottom
C6  15.49,72.14 180 bottom
C7  15.49,69.34 180 bottom
C8  17.78,74.42 180 bottom
C9  23.88,24.38 270 top
C10  31.75,17.02 0 top
C11  55.37,71.12 180 top
C13  22.86,51.56 180 top
C_C1  25.65,59.44 270 top
C_CSPOUT  33.02,31.24 270 top
C_DACI  11.18,52.07 0 top
C_DACO  15.75,14.22 90 top
C_IMON_IN  68.07,31.5 180 bottom
C_IMON_OUT  63.75,54.36 270 bottom
C_IN1  15.49,59.69 270 top
C_IN1_2  25.65,72.39 90 top
C_IN1_3  15.49,72.39 90 top
C_IN2  22.35,59.69 270 top
C_IN2_2  8.38,59.69 270 top
C_IN3  36.83,72.39 270 top
C_IN3_2  33.02,72.39 270 top
C_IN4  41.15,75.95 270 top
C_IN5  24.89,47.75 90 top
C_IN6  62.99,65.79 0 top
C_IN7  50.8,65.79 0 top
C_OUT1  19.3,34.8 90 top
C_OUT2  20.83,24.38 270 top
C_OUT2_2  17.27,24.38 270 top
C_OUT3  34.29,38.61 90 top
C_OUT3_2  30.48,38.61 90 top
C_OUT4  29.97,30.48 270 top
C_S1  28.19,59.44 270 top
C_S2  35.31,30.73 270 top
CURRENT_SENSE  19.56,8.89 270 top
D3  57.66,65.79 0 top
D4  60.71,68.83 180 top
D_S  66.55,38.35 90 bottom
I2C_COMM  25.15,8.64 0 top
IC1  32.51,7.62 90 top
L1  60.45,49.53 270 top
M1  41.66,65.79 90 top
M2  37.34,53.09 270 top
M3  37.34,44.7 270 top
M4  41.4,34.8 90 top
R4  64.01,49.02 90 bottom
R5  13.21,61.72 0 bottom
R6  18.54,61.72 0 bottom
R7  23.88,14.99 90 top
R8  26.42,14.99 90 top
R9  70.61,36.83 180 bottom
R10  22.61,62.74 90 bottom
R12  24.38,72.14 90 bottom
R13  19.05,70.61 90 bottom
R18  29.46,74.42 180 bottom
R20  45.97,77.22 180 top
R21  51.31,77.22 180 top
R22  11.18,46.23 180 top
R23  11.18,43.94 0 top
R24  55.37,68.83 180 top
R_BAT  12.95,33.02 180 top
R_DACI1  14.99,50.55 270 top
R_DACI2  11.18,49.53 0 top
R_DACO1  12.95,14.22 270 top
R_DACO2  15.75,19.3 270 top
R_DSA  66.55,43.43 270 bottom
R_FBIN1  7.11,53.09 90 top
R_FBIN2  7.11,48.01 90 top
R_FBOUT1  12.95,24.64 90 top
R_FBOUT2  12.95,19.3 270 top
R_IMON_IN  68.07,34.04 180 bottom
R_IMON_OUT  66.55,54.36 270 bottom
R_IOR  69.09,49.02 270 bottom
R_IOW  66.55,49.02 270 bottom
R_S1  32.26,59.44 270 top
R_S2  28.19,26.16 180 top
SENSE_IN  30.73,64.01 180 top
SENSE_OUT  27.94,34.54 180 top
SHUNT_NFET  13.72,8.13 180 top
TG1  49.02,68.58 0 top
TG2  27.94,51.56 0 top
TG3  28.19,49.02 180 top
TG4  22.35,47.75 90 top
TG5  27.94,42.67 180 top
U1  41.4,49.28 180 bottom

### Tracks (layer width: path | path; a pad name or v marks a point on that pad's centre or on a via)
0  (via drill 0.35, 3.3 pad 6.1)
  Top 0.152: C_CSPOUT.2 32.51,29.92 v32.51,28.7 32.33,28.88 C_OUT4.2 29.84,28.96 28.42,30.39 | 56.83,73.25 56.83,73.88 C2.1 56.83,73.25 | 56.83,73.25 56.83,71.18 C11.1 | 56.83,73.25 52.86,77.22 R21.1 52.71,77.22 50.01,74.52 45.72,74.52 | 36.83,73.88 33.02,73.88 C_IN3_2.1 | 36.83,73.88 36.83,74.36 41.12,74.36 C_IN4.2 41.28,74.52 45.72,74.52 | 36.83,73.88 C_IN3.1 | 20.64,75.79 25.56,75.79 C_IN1_2.2 25.72,75.95 25.72,78.49 45.4,78.49 45.72,78.17 45.72,74.52 | 20.64,75.79 15.56,75.79 C_IN1_3.2 | v20.64,75.63 20.64,75.79 | v68.1,34.83 v68.1,45.62 68.1,49.44 L1.3 | ARDUINO_NANO1.14 42.7,21.34 47.62,16.42 47.62,6.1 ARDUINO_NANO1.19 | C9.2 23.81,23.08 20.95,23.08 C_OUT2.2 20.8,23.08 17.3,23.08 C_OUT2_2.2 17.14,22.92 17.14,19.59 16.99,19.59 | 16.99,19.59 14.61,19.59 13.02,18 R_FBOUT2.2 | IC1.2 32.38,10.22 31.11,11.49 31.11,16.26 30.48,16.89 C10.1 30.32,17.05 28.42,18.96 28.42,30.39 | 16.99,12.76 19.53,12.76 19.53,11.49 CURRENT_SENSE.1 | 16.99,12.76 15.88,12.76 C_DACO.1 | 16.99,12.76 16.99,19.59 | 8.41,53.4 9.68,52.13 C_DACI.1 | 8.41,53.4 8.41,58.17 C_IN2_2.2 8.41,58.33 v9.53,59.44 | v15.72,58.8 15.56,58.64 15.56,56.42 C_IN1.2 15.4,56.26 11.43,56.26 11.43,45.62 9.84,44.04 R23.1 9.68,44.04 7.3,44.04 | 7.3,44.04 7.3,46.42 7.14,46.58 R_FBIN2.1 6.98,46.74 5.87,47.85 5.87,53.4 8.41,53.4 | 7.37,39.37 6.79,39.94 6.79,44.04 7.3,44.04 | 30.48,39.91 34.29,39.91 C_OUT3.2 34.29,40.23 v35.72,41.66 | 28.42,30.39 28.26,30.54 28.26,37.69 30.16,39.59 | 30.48,39.91 30.16,39.59 | 30.48,39.91 C_OUT3_2.2 30.16,39.59 | C_C1.2 25.72,58.01 v27.15,56.58 24.92,54.36 24.92,53.72 24.29,53.09 21.43,53.09 | 21.43,53.09 21.43,57.37 22.22,58.17 C_IN2.2
  Top 0.152: 21.43,53.09 21.43,51.66 C13.2 21.59,51.5 22.22,50.86 22.22,49.28 TG4.2 22.22,49.12 21.11,48.01 21.11,41.66 19.37,39.91 C_OUT1.2 | 30.16,39.59 28.26,41.5 28.26,43.88 28.57,44.2 28.57,45.31 27.46,46.42 27.46,48.96 TG3.2
  Top 0.305: TG3.2 25.02,49.02 C_IN5.2 22.37,49.15 TG4.2
  Bottom 0.152: 15.72,67.85 15.56,67.85 14.13,69.28 C7.1 14.13,69.44 14.13,72.14 | 15.72,67.85 17.14,67.85 | 17.14,67.85 22.22,67.85 22.22,68.96 C5.1 | 14.13,72.14 16.35,74.36 C8.1 16.51,74.52 17.62,75.63 v20.64,75.63 26.83,75.63 27.94,74.52 R18.1 | 14.13,72.14 C6.1 | 17.14,67.85 17.14,64.04 C3.1 | 15.72,67.85 11.91,64.04 C1.1 11.91,63.88 11.91,61.82 R5.2 11.75,61.66 v9.53,59.44 | 40.96,44.51 40.32,44.51 | 40.32,44.51 39.69,44.51 39.69,43.88 U1.62 39.69,43.72 39.69,41.66 v35.72,41.66 | 40.96,44.51 41.12,44.36 41.12,43.88 U1.59 | 40.96,44.51 43.18,44.51 43.18,43.88 U1.55 | 40.32,48.48 40.48,48.48 41.28,49.28 U1.PAD | 40.32,48.48 38.58,48.48 U1.9 | 40.32,48.48 40.32,44.51 | 40.32,48.48 U1.PAD | C_IMON_OUT.1 63.82,55.78 66.52,55.78 R_IMON_OUT.1 66.67,55.63 70.33,51.97 70.33,48.8 67.47,48.8 | 67.47,48.8 65.72,48.8 64.14,50.39 R4.2 63.98,50.55 63.5,51.02 43.18,51.02 41.43,49.28 U1.PAD | 67.47,48.8 67.79,48.48 67.79,45.62 | 67.79,45.62 67.79,44.99 66.67,44.99 R_DSA.1 | 66.67,34.04 C_IMON_IN.1 | 66.67,34.04 67.47,34.83 v68.1,34.83 | 66.67,34.04 R_IMON_IN.1 | v68.1,45.62 67.79,45.62 | SHUNT_NFET.3 8.73,8.16 11.91,11.34 19.53,11.34 CURRENT_SENSE.1 19.68,11.34 20.64,11.34 | 20.64,11.34 31.27,11.34 32.38,10.22 IC1.2 | 20.64,11.34 32.7,23.4 40.48,23.4 42.55,21.34 ARDUINO_NANO1.14 | v15.72,58.8 16.67,58.8 16.99,59.12 C4.1 | v27.15,56.58 27.3,56.74 35.4,56.74 36.2,55.94 37.47,55.94 38.58,54.83 U1.21 | 7.37,39.37 7.46,39.43 7.78,39.75 19.21,39.75 C_OUT1.2
  other vias: 7.11,76.45 6.6,40.39
  pour Bottom: -1.52,84.07 86.11,84.07 87.88,82.3 87.88,-0.51 86.61,-1.78 0.51,-1.78 -3.3,2.03 -3.3,82.3
  pour Top: -0.25,83.06 -0.25,72.9 42.93,72.9 43.18,72.64 43.94,71.88 43.94,69.85 51.56,69.85 51.82,69.6 51.82,32 50.29,30.48 50.04,30.23 30.48,30.23 28.7,28.45 28.7,24.13 12.7,24.13 11.18,22.61 11.18,19.05 10.41,18.29 -0.25,18.29 -0.51,18.03 -0.51,0.25 0.25,-0.51 83.57,-0.51 87.12,3.05 87.12,82.55 86.11,83.57 0.25,83.57
  pour Top: 1.02,14.73 1.02,73.41 2.54,73.41 2.54,59.18 27.43,59.18 27.43,45.72 32.26,40.89 35.81,40.89 35.81,39.37 16.26,39.37 13.72,36.83 4.83,36.83 2.54,34.54 2.54,16.26
5V
  Top 0.152: ARDUINO_NANO1.12 47.62,21.34 46.2,22.77 41.12,22.77 41.12,13.72 33.66,6.26 19.68,6.26 CURRENT_SENSE.3
ANALOG_IN
  Bottom 0.152: ARDUINO_NANO1.4 67.95,21.34 55.25,8.64 36.04,8.64 33.66,6.26 22.22,6.26 19.68,8.8 CURRENT_SENSE.2
AV_DD___V_DD___LDO33  (via drill 0.35)
  Top 0.152: v35.72,51.34 35.88,51.18 35.88,49.12 | 35.88,49.12 35.88,46.39 v35.72,46.23 | 26.04,16.42 26.35,16.42 R8.2 26.04,16.42 | 26.04,16.42 23.97,16.42 R7.2 | v43.82,38.48 v41.43,40.86 | v26.04,17.84 26.04,16.42 | v48.58,29.43 50.16,31.02 v50.16,38.48 50.16,47.05 49.05,48.16 49.05,49.12 35.88,49.12 | v21.43,62.77 17.3,62.77 v17.3,51.5
  Bottom 0.152: C4.2 20,59.28 20,61.66 R6.1 20,61.82 20,63.88 C3.2 20,64.04 21.43,64.04 | 21.43,64.04 22.54,64.04 R10.2 | v35.72,46.23 35.85,46.1 38.42,46.1 U1.4 | U1.14 37.94,51.02 36.04,51.02 v35.72,51.34 35.4,51.66 27.78,51.66 27.46,51.34 17.46,51.34 v17.3,51.5 | v41.43,40.86 41.59,40.86 41.59,43.72 U1.58 | v43.82,38.48 v50.16,38.48 70.33,38.48 71.91,36.89 R9.2 | v26.04,17.84 37.62,29.43 v48.58,29.43 | v21.43,62.77 21.43,64.04
BG1  (via drill 0.35)
  Top 0.152: v36.83,56.74 36.04,55.94 36.04,52.61 34.77,51.34 34.77,51.18 M2.4
  Bottom 0.152: v36.83,56.74 39.69,56.74 39.69,54.83 U1.23
BG2  (via drill 0.35)
  Top 0.152: v40.96,59.28 v40.96,56.42 | v18.89,44.67 v18.89,57.53 | v24.92,44.36 26.51,42.77 TG5.2
  Bottom 0.152: v40.96,56.42 40.64,56.42 40.64,54.83 U1.25 | v40.96,59.28 40.64,59.59 24.76,59.59 22.7,57.53 v18.89,57.53 | v18.89,44.67 19.21,44.36 v24.92,44.36
BOOST1  (via drill 0.35)
  Top 0.152: 53.02,65.79 v53.02,54.04
  Top 0.813: D3.1 53.02,65.79 C_IN7.2
  Bottom 0.152: v53.02,54.04 44.93,54.04 U1.33
BOOST2  (via drill 0.35)
  Top 0.152: v60.33,64.36 v55.4,59.44 | v63.02,67.06 63.07,67.11
  Top 0.813: D4.1 62.36,68.8 62.36,67.82 63.07,67.11 C_IN6.2
  Bottom 0.152: v55.4,59.44 52.71,56.74 42.23,56.74 41.59,56.1 41.59,54.83 U1.27 | v63.02,67.06 v60.33,64.36
CA  (via drill 0.35)
  Top 0.152: v21.43,59.75 19.68,58.01 19.68,42.77 18.26,41.34 18.26,39.43 18.89,38.8 27.78,38.8 v27.78,44.36
  Bottom 0.152: v21.43,59.75 22.54,59.75 22.54,61.18 R10.1 | v27.78,44.36 28.42,44.99 38.42,44.99 U1.2
CLKDET  (via drill 0.35)
  Top 0.152: v50.96,41.81 50.8,41.97 v50.8,66.58
  Bottom 0.152: v50.96,41.81 42.7,41.81 42.7,43.72 U1.56 | v50.8,66.58 49.53,67.85 27.3,67.85 24.45,70.71 R12.1 24.29,70.71 22.38,70.71 C5.2
CLKOUT  (via drill 0.35)
  Top 0.152: v35.24,55.94 36.04,56.74 36.04,56.9 v40.48,61.34
  Bottom 0.152: v35.24,55.94 35.72,55.47 36.51,55.47 37.94,54.04 U1.20 | v40.48,61.34 44.93,65.79 50.96,65.79 51.59,66.42 51.59,68.33 29.53,68.33 24.45,73.41 R12.2
CSN  (via drill 0.35)
  Top 0.152: v33.66,50.07 33.66,47.37 32.77,46.48 v32.48,46.48 | v26.51,46.48 24.92,46.48 24.92,46.42 C_IN5.1
  Top 0.305: TG4.1 22.37,46.35 C_IN5.1
  Bottom 0.152: v33.66,50.07 37.94,50.07 U1.12 | v32.48,46.48 v26.51,46.48
CSNIN  (via drill 0.35)
  Top 0.152: v52.23,48.32 52.39,48.48 52.39,53.72 52.07,54.04 v52.07,58.01 | v33.81,58.01 32.38,58.01 R_S1.2
  Top 0.305: C_S1.2 32.24,58.04 R_S1.2
  Bottom 0.152: v52.23,48.32 51.44,48.32 51.12,48.64 46.51,48.64 45.88,48.01 45.88,47.69 45.24,47.05 43.34,47.05 43.34,48.32 43.5,48.48 44.29,48.48 U1.44 | v33.81,58.01 v52.07,58.01
CSNOUT  (via drill 0.35)
  Top 0.152: v55.88,46.89 57.47,45.31 57.47,23.24 58.9,21.81 58.9,20.86 57.94,19.91 48.74,19.91 48.74,21.81 41.43,29.11 35.56,29.11 C_S2.2
  Top 0.305: C_S2.2 35.28,29.33
  Top 0.813: C_S2.2 32.13,26.16 R_S2.1
  Bottom 0.152: v55.88,46.89 52.39,50.39 51.28,50.39 50.96,50.07 44.93,50.07 U1.41
CSP  (via drill 0.35)
  Top 0.152: v27.94,50.86 26.67,50.86 26.67,51.5 TG2.1
  Top 0.305: C13.1 TG2.1
  Bottom 0.152: v27.94,50.86 33.81,50.86 34.13,50.55 37.94,50.55 U1.13
CSPIN___V_IN  (via drill 0.35, 3.3 pad 6.1)
  Top 0.152: v51.59,49.12 51.28,49.44 51.28,58.64 v51.59,58.96 | 6.67,59.75 6.67,54.83 6.98,54.52 R_FBIN1.2 | 10.95,59.75 10.95,47.37 9.84,46.26 R22.2
  Top 0.406: C_IN1_2.1 30.48,73.82 30.48,76.71 31.19,77.42 C_IN4.1 44.35,77.42 R20.2
  Top 0.813: SENSE_IN.2 19.3,64.01 16.51,66.8 13.72,66.8 11.68,68.83 7.87,68.83
  Bottom 0.152: 44.45,48.01 44.45,47.53 U1.46 | 44.45,48.01 45.24,48.01 46.36,49.12 v51.59,49.12 | v51.59,58.96 50.48,60.07 30.8,60.07 v30.48,60.39 | 44.45,48.01 U1.45
  other vias: 6.86,68.58
  pour Top: 3.3,72.39 3.3,59.69 30.48,59.69 30.48,72.39
EXTV_CC___CSPOUT  (via drill 0.35)
  Top 0.152: v53.34,48.32 52.07,47.05 v52.07,41.81 | v41.91,37.69 40.64,36.42 40.64,34.83 M4.9
  Top 0.813: 37.35,34.54 37.86,34.54 M4.7 | C_S2.1 35.31,32.5 M4.6 37.35,34.54 | 37.35,34.54 33.53,34.54 | 33.53,34.54 32.77,34.54 | 32.77,34.54 SENSE_OUT.1 29.97,33.91 C_OUT4.1 | C_CSPOUT.1 33.02,34.04 33.53,34.54 | C_OUT3.1 34.29,36.07 33.02,34.8 | 33.02,34.8 32.77,34.54 | C_OUT3_2.1 30.54,37.28 33.02,34.8
  Bottom 0.152: U1.40 44.77,50.55 44.29,50.55 44.13,50.39 44.13,49.59 44.29,49.59 U1.42 44.45,49.59 51.12,49.59 51.44,49.91 51.75,49.91 v53.34,48.32 | v52.07,41.81 49.53,39.28 43.5,39.28 v41.91,37.69
  pour Top: 42.42,38.35 42.42,31.24 28.19,31.24 28.19,38.35
FBIN___FBIR  (via drill 0.35)
  Top 0.152: R_FBIN1.1 R_FBIN2.2 7.21,49.53 8.41,49.53 | 8.41,49.53 R_DACI2.1 | v8.26,45.15 8.41,45.31 8.41,49.53 | 8.41,49.59 8.41,49.53 | v18.1,43.56 v18.1,52.13
  Bottom 0.152: v8.26,45.15 9.84,43.56 v18.1,43.56 27.94,43.56 28.73,44.36 37.78,44.36 37.94,44.51 U1.1 | v18.1,52.13 35.88,52.13 36.51,51.5 37.94,51.5 U1.15
FBIW  (via drill 0.35)
  Top 0.152: v16.99,47.21 15.08,49.12 R_DACI1.2
  Bottom 0.152: v16.99,47.21 17.3,47.53 35.88,47.53 36.51,46.89 37.47,46.89 37.62,47.05 38.42,47.05 U1.6
FBOR___FBOUT  (via drill 0.35)
  Top 0.152: v23.65,33.4 17.3,27.05 14.61,27.05 14.61,24.83 13.02,23.24 R_FBOUT1.1 R_FBOUT2.1 13.02,20.7 15.72,20.7 R_DACO2.1 | v20.64,53.09 20.32,52.77 v20.32,42.45
  Bottom 0.152: v23.65,33.4 26.51,36.26 | 26.51,36.26 30,39.75 42.23,39.75 42.23,43.72 U1.57 | v20.64,53.09 21.11,52.61 36.04,52.61 36.67,51.97 37.94,51.97 U1.16 | 26.51,36.26 v20.32,42.45
FBOW  (via drill 0.35)
  Top 0.152: R_DACO1.2 6.96,18.8 4.57,18.8 3.05,20.32 3.05,45.21 v3.81,45.97 4.57,46.74 v4.57,49.28
  Bottom 0.152: U1.5 36.35,46.52 35.74,47.14 26.24,47.14 25.63,46.54 8.32,46.54 6.02,48.84 5.01,48.84 v4.57,49.28
GATEV_CC___INTV_CC  (via drill 0.35)
  Top 0.152: v54.61,67.06 54.13,67.53 54.13,68.33 R24.2 | v22.22,54.36 23.34,55.47 v23.34,55.94
  Top 0.813: R24.2 53.97,68.61 C11.2 C2.2
  Bottom 0.152: 40.16,57.21 40.16,54.83 U1.24 | 40.16,57.21 52.23,57.21 54.61,59.59 v54.61,67.06 | v22.22,54.36 12.86,54.36 12.86,47.69 13.65,46.89 15.24,46.89 16.35,48.01 36.04,48.01 36.67,47.37 37.15,47.37 37.31,47.53 38.42,47.53 U1.7 | v23.34,55.94 24.76,57.37 33.5,57.37 33.66,57.21 36.35,57.21 36.67,57.53 39.85,57.53 40.16,57.21
GATEVCC'
  Top 0.813: D3.2 59.08,65.99 D4.2 R24.1
IMON_IN___IIR  (via drill 0.35)
  Top 0.152: v68.1,33.56 v58.26,43.4 | v15.08,47.69 17.3,45.47 v17.3,38.8
  Bottom 0.152: v58.26,43.4 44.45,43.4 44.13,43.72 U1.53 | v68.1,33.56 68.58,34.04 R_IMON_IN.2 69.53,34.04 69.53,31.5 C_IMON_IN.2 69.37,31.5 68.1,30.23 25.88,30.23 v17.3,38.8 | v15.08,47.69 15.88,48.48 33.66,48.48 34.13,48.96 38.42,48.96 U1.10
IMON_OUT  (via drill 0.35)
  Top 0.152: v29.21,54.36 31.75,56.9 35.56,56.9 v35.56,60.86 | v53.82,53.4 v53.82,60.55
  Bottom 0.152: 66.52,52.93 66.52,50.55 R_IOW.1 66.67,50.55 69.06,50.55 R_IOR.1 | v29.21,54.36 28.89,54.67 23.34,54.67 23.34,53.72 23.97,53.09 36.2,53.09 36.67,52.61 37.94,52.61 U1.17 | v35.56,60.86 35.88,60.55 v53.82,60.55 | v53.82,53.4 54.13,53.09 63.66,53.09 C_IMON_OUT.2 63.82,52.93 66.52,52.93 | 66.52,52.93 R_IMON_OUT.2
IOR  (via drill 0.35)
  Top 0.152: v40.8,37.85 v37.78,40.86
  Bottom 0.152: v37.78,40.86 34.61,40.86 34.61,42.93 35.56,43.88 38.58,43.88 U1.64 | v40.8,37.85 43.02,35.62 73.03,35.62 73.18,35.78 73.18,47.53 69.22,47.53 R_IOR.2
IOW
  Bottom 0.152: R_IOW.2 66.52,47.53 64.45,45.47 44.29,45.47 U1.50
N$1
  Top 0.813: M1.7 32.73,65.15 SENSE_IN.1
  pour Top: 30.99,59.69 30.99,72.39 42.42,72.39 42.42,59.69
N$2
  Top 0.813: M3.2 32.13,45.34 31.24,46.23 31.24,49.78 | 31.24,49.78 31.24,52.32 32.64,53.72 M2.2 | TG3.1 29.81,49.78 31.24,49.78 | TG2.2 31.75,51.56 31.75,50.29 31.24,49.78
  pour Top: 35.56,43.43 30.99,43.43 28.19,46.23 28.19,52.83 30.99,55.63 35.56,55.63 35.56,52.07 33.27,52.07 33.27,47.5 34.04,46.74 35.56,46.74
N$3
  Top 0.305: TG1.1 46.71,67.69 M1.4
N$4
  Top 0.152: R_DACI2.2 12.6,52.05 C_DACI.2 12.68,51.97 R_DACI1.1
N$5
  Top 0.305: TG5.1 29.49,42.8 M3.4
N$6  (via drill 1.78 pad 3.56)
  other vias: 7.37,33.27
  pour Top: 12.45,31.24 12.45,35.56 5.33,35.56 5.33,31.24
N$7
  Top 0.813: IC1.3 32.51,16.38 C10.2 35.16,19.03 38.55,19.03 39.9,20.38 39.9,21.11 ARDUINO_NANO1.15
N$8  (via drill 1.78 pad 3.56)
  Top 0.152: v7.62,14.48 7.62,14.35 11.11,10.86 11.11,8.16 SHUNT_NFET.2
N$9
  Bottom 0.152: ARDUINO_NANO1.21 52.71,6.1 50.64,8.16 36.2,8.16 33.81,5.78 21.75,5.78 19.84,7.68 14.13,7.68 13.81,8 SHUNT_NFET.1
N$23
  Top 0.152: 12.55,16.05 R_DACO1.1 13.02,15.62 15.4,15.62 C_DACO.2 15.73,15.65 15.47,15.65 15.75,15.92 R_DACO2.2
N$28
  Bottom 0.152: D_S.C 66.52,39.91 66.52,41.97 R_DSA.2
N$32
  Bottom 0.152: C7.2 16.99,69.28 19.05,69.28 R13.1
RT  (via drill 0.35)
  Top 0.152: v38.89,55.94 40.16,57.21 40.16,59.44 43.02,62.29 v43.02,69.12
  Bottom 0.152: v38.89,55.94 39.21,55.94 39.21,54.83 U1.22 | v43.02,69.12 37.78,74.36 30.96,74.36 R18.2
SCL  (via drill 0.35)
  Top 0.152: I2C_COMM.1 R7.1 23.97,13.72 v25.24,14.99 | v35.72,43.09 36.04,42.77 36.04,42.29 36.99,41.34 v36.99,38.96 | v45.4,31.02 53.66,22.77 55.25,22.77 55.25,21.34 ARDUINO_NANO1.9
  Bottom 0.152: v35.72,43.09 39.21,43.09 39.21,43.72 U1.63 | v36.99,38.96 44.93,31.02 v45.4,31.02 | v25.24,14.99 29.53,19.27 53.18,19.27 55.25,21.34 ARDUINO_NANO1.9
SDA  (via drill 0.35)
  Top 0.152: I2C_COMM.2 R8.1 26.51,13.72 26.83,14.03 v26.83,14.99 | v40.16,40.55 42.7,38 42.7,31.18 51.59,22.29 54.29,22.29 54.29,21.02 54.93,20.38 57.79,20.38 57.79,21.34 ARDUINO_NANO1.8
  Bottom 0.152: v40.16,40.55 40.16,43.72 U1.61 | v26.83,14.99 30.64,18.8 55.25,18.8 57.79,21.34 ARDUINO_NANO1.8
SHDN  (via drill 0.35)
  Top 0.152: R23.2 R22.1 12.7,46.26 12.7,46.42 v13.97,47.69
  Bottom 0.152: v13.97,47.69 15.24,48.96 33.5,48.96 33.97,49.44 38.42,49.44 U1.11
SS  (via drill 0.35)
  Top 0.152: v18.26,67.06 17.78,67.53 v17.78,73.72
  Bottom 0.152: v18.26,67.06 18.26,58.17 18.1,58.01 18.1,57.37 20.32,55.15 35.4,55.15 36.99,53.56 37.94,53.56 U1.19 | v17.78,73.72 18.41,74.36 19.05,74.36 C8.2
STATUS  (via drill 0.35)
  Top 0.152: v64.93,37.69 v63.34,39.28
  Bottom 0.152: R9.1 69.06,36.89 66.67,36.89 D_S.A 66.52,37.05 65.56,37.05 v64.93,37.69 | v63.34,39.28 57.63,44.99 44.29,44.99 U1.51
SW1  (via drill 0.35)
  Top 0.813: L1.1 46.1,60.58 46.99,61.47 46.99,62.48 M1.2 | C_IN7.1 44.95,65.79 M1.3
  Bottom 0.152: v49.53,55.31 49.37,55.47 43.66,55.47 43.66,54.83 U1.31
  pour Top: 42.93,67.06 50.29,67.06 50.29,50.29 36.32,50.29 36.32,55.63 42.93,55.63
SW2  (via drill 0.35)
  Top 0.152: v49.53,51.82 49.53,48.26 | C_IN6.1 61.44,65.79 61.12,65.47 61.12,57.53 v55.88,52.29 64.72,52.29 65.42,52.99 70.93,52.99 71.09,52.82 71.09,35.62 68.38,32.9 67.83,32.9 67.71,33.02 v58.42,33.02 | v56.39,33.02 53.1,33.02 48.85,28.77 48.3,28.77 47.92,29.16 47.92,29.44 44.46,32.89 M4.1
  Top 0.813: M4.2 46.86,34.16 48.51,35.81 48.51,42.04 L1.2 41.39,44.45 M3.7
  Bottom 0.152: U1.29 42.7,54.67 43.82,53.56 47.78,53.56 v49.53,51.82 55.4,51.82 v55.88,52.29 | v58.42,33.02 v56.39,33.02
  pour Top: 36.32,48.26 49.78,48.26 49.78,31.24 45.72,31.24 45.72,41.15 36.32,41.15
  pour Top: 49.78,31.24 43.18,31.24 43.18,36.07 49.78,36.07
SWEN___SWENO  (via drill 0.35)
  Top 0.152: v36.99,48.16 37.47,48.64 46.67,48.64 v46.67,47.85
  Bottom 0.152: 46.67,46.1 44.29,46.1 U1.49 | 46.67,46.1 62.55,46.1 63.98,47.53 R4.1 | v36.99,48.16 37.15,48.01 38.42,48.01 U1.8 | 46.67,46.1 v46.67,47.85
TEMPSENSE  (via drill 0.35)
  Bottom 0.152: R5.1 8.03,55.12 6.35,55.12 3.81,52.58 v3.81,47.75 4.1,47.47 6.89,47.47 8.89,45.47 38.42,45.47 U1.3 | C1.2 14.61,63.88 14.61,61.82 R5.1 | R6.2 16.99,61.82 14.76,61.82 R5.1
TG1  (via drill 0.35)
  Top 0.152: v52.39,67.85 50.48,67.85 50.48,68.48 TG1.2
  Bottom 0.152: v52.39,67.85 56.2,67.85 56.2,55.94 55.56,55.31 53.34,55.31 52.55,54.52 44.29,54.52 44.13,54.67 U1.32
TG2  (via drill 0.35)
  Top 0.152: v55.4,56.1 55.09,55.78 55.09,41.81 v50.96,37.69 | v44.93,37.53 44.13,36.73 M4.4
  Bottom 0.152: v55.4,56.1 42.23,56.1 42.23,54.83 U1.28 | v50.96,37.69 50.8,37.53 v44.93,37.53
V_BAT  (via drill 1.78 pad 3.56, 3.3 pad 6.1)
  Top 0.813: IC1.1 27.93,12.2 27.93,17.46 26.77,18.62 R_S2.2 26.77,34.31 SENSE_OUT.2 19.56,34.54 C_OUT1.1 16.15,34.8 R_BAT.1 14.48,32.92 14.48,29.21 13.21,27.94 7.87,27.94 v7.87,21.59
  other vias: 7.37,27.18
  pour Top: 27.69,38.35 17.27,38.35 13.46,34.54 13.46,30.48 6.35,30.48 5.33,29.46 5.33,26.42 6.86,24.89 27.18,24.89 27.69,25.4
  pour Top: 3.56,30.48 3.56,19.3 10.41,19.3 10.41,30.48
V_C  (via drill 0.35)
  Top 0.152: v24.13,59.91 v24.13,53.88 | v21.11,68.64 v22.54,67.22
  Bottom 0.152: v24.13,53.88 24.45,53.56 36.35,53.56 36.83,53.09 37.94,53.09 U1.18 | v24.13,59.91 24.13,67.22 v22.54,67.22 | v21.11,68.64 21.11,71.98 19.05,71.98 R13.2 19.05,72.14 C6.2
VINR  (via drill 0.35)
  Top 0.152: R20.1 R21.2 50.01,77.22 50.01,78.49 54.45,78.49 60.17,72.77 60.17,65.15 54.61,59.59 54.61,44.36 v52.86,42.61
  Bottom 0.152: v52.86,42.61 43.66,42.61 43.66,43.72 U1.54

### Text on the board
tNames: Brandon Hickey / MPPT Charger V2 / 3/22/2021 | BAT_GND | BAT_RES_POS | BAT_POS | SHUNT_POS | SHUNT_NEG